# EAGLE design LIC_rack_TS-01 (EAGLE 7.2.0)
AUTHOR: M. Petrilak; VERSION: 00

## Sheet 1 of 3
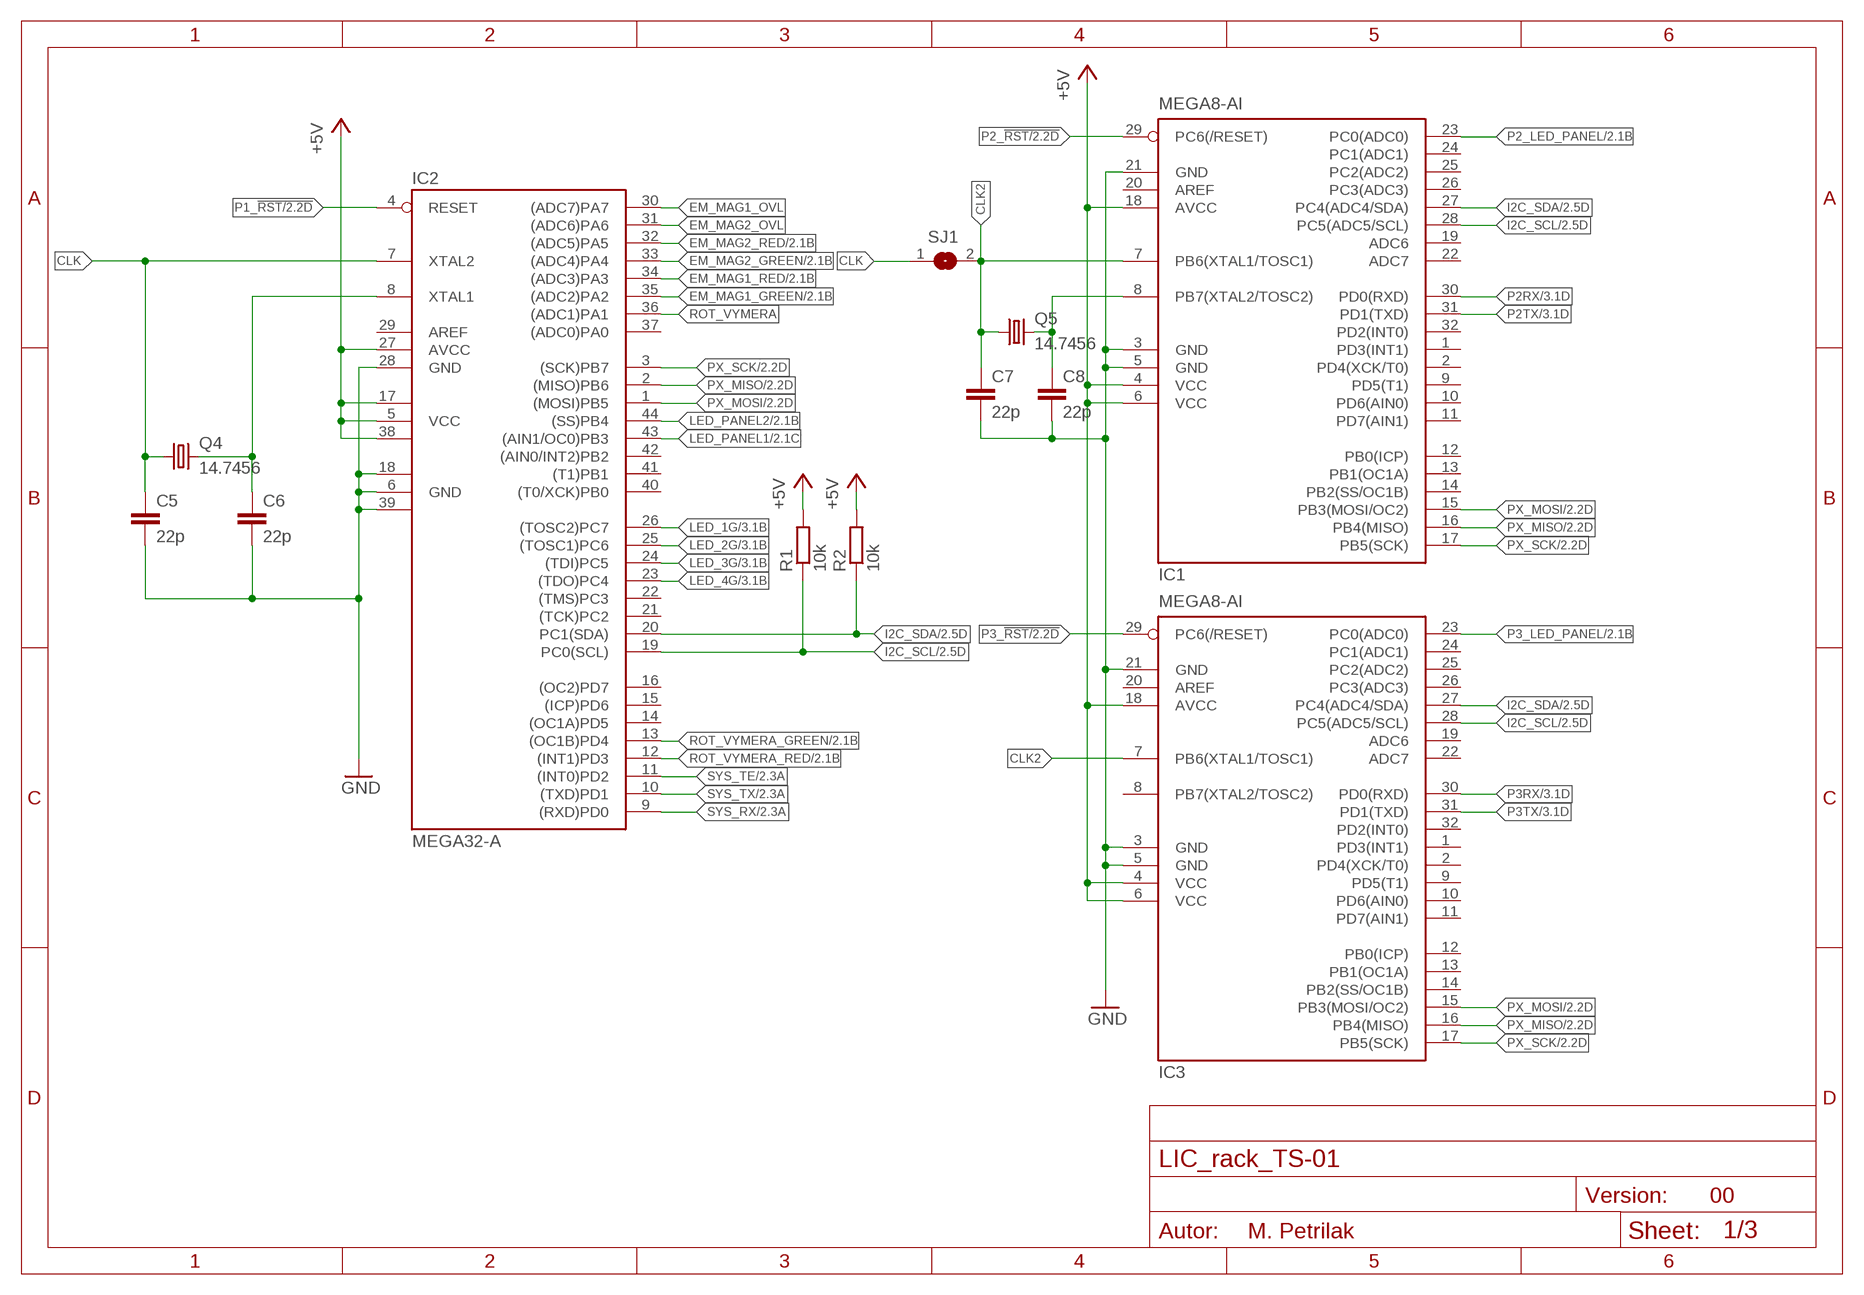
[diagram p0: schematic, sheet 1]

### Parts
C5  22p  C-EUC0805  [C0805]
C6  22p  C-EUC0805  [C0805]
C7  22p  C-EUC0805  [C0805]
C8  22p  C-EUC0805  [C0805]
IC1  MEGA8-AI  [TQFP32-08]
IC2  MEGA32-A  [TQFP44]
IC3  MEGA8-AI  [TQFP32-08]
Q4  14.7456  XTAL  [HC49U70]
Q5  14.7456  XTAL  [HC49U70]
R1  10k  R-EU_R1206  [R1206]
R2  10k  R-EU_R1206  [R1206]
SJ1  SJ-DEFAULT  [SJ-D]

### Nets
+5V: IC1.4(VCC) IC1.6(VCC) IC1.18(AVCC) IC2.5(VCC) IC2.17(VCC1) IC2.27(AVCC) IC2.38(VCC2) IC3.4(VCC) IC3.6(VCC) IC3.18(AVCC) R1.2 R2.2 ; also sheet 2,3
CLK: C5.1 IC2.7(XTAL2) Q4.1 SJ1.1
CLK2: C7.1 IC1.7(PB6(XTAL1/TOSC1)) IC3.7(PB6(XTAL1/TOSC1)) Q5.1 SJ1.2
EM_MAG1_GREEN: IC2.35((ADC2)PA2) ; also sheet 2
EM_MAG1_OVL: IC2.30((ADC7)PA7) ; also sheet 3
EM_MAG1_RED: IC2.34((ADC3)PA3) ; also sheet 2
EM_MAG2_GREEN: IC2.33((ADC4)PA4) ; also sheet 2
EM_MAG2_OVL: IC2.31((ADC6)PA6) ; also sheet 3
EM_MAG2_RED: IC2.32((ADC5)PA5) ; also sheet 2
GND: C5.2 C6.2 C7.2 C8.2 IC1.3(GND) IC1.5(GND) IC1.21(GND) IC2.6(GND) IC2.18(GND1) IC2.28(GND) IC2.39(GND2) IC3.3(GND) IC3.5(GND) IC3.21(GND) ; also sheet 2,3
I2C_SCL: IC1.28(PC5(ADC5/SCL)) IC2.19(PC0(SCL)) IC3.28(PC5(ADC5/SCL)) R1.1 ; also sheet 2
I2C_SDA: IC1.27(PC4(ADC4/SDA)) IC2.20(PC1(SDA)) IC3.27(PC4(ADC4/SDA)) R2.1 ; also sheet 2
LED_1G: IC2.26((TOSC2)PC7) ; also sheet 3
LED_2G: IC2.25((TOSC1)PC6) ; also sheet 3
LED_3G: IC2.24((TDI)PC5) ; also sheet 3
LED_4G: IC2.23((TDO)PC4) ; also sheet 3
LED_PANEL1: IC2.43((AIN1/OC0)PB3) ; also sheet 2
LED_PANEL2: IC2.44((SS)PB4) ; also sheet 2
N$17: C8.1 IC1.8(PB7(XTAL2/TOSC2)) Q5.2
N$19: C6.1 IC2.8(XTAL1) Q4.2
P1_!RST: IC2.4(RESET) ; also sheet 2
P2_!RST: IC1.29(PC6(/RESET)) ; also sheet 2
P2_LED_PANEL: IC1.23(PC0(ADC0)) ; also sheet 2
P2RX: IC1.30(PD0(RXD)) ; also sheet 3
P2TX: IC1.31(PD1(TXD)) ; also sheet 3
P3_!RST: IC3.29(PC6(/RESET)) ; also sheet 2
P3_LED_PANEL: IC3.23(PC0(ADC0)) ; also sheet 2
P3RX: IC3.30(PD0(RXD)) ; also sheet 3
P3TX: IC3.31(PD1(TXD)) ; also sheet 3
PX_MISO: IC1.16(PB4(MISO)) IC2.2((MISO)PB6) IC3.16(PB4(MISO)) ; also sheet 2
PX_MOSI: IC1.15(PB3(MOSI/OC2)) IC2.1((MOSI)PB5) IC3.15(PB3(MOSI/OC2)) ; also sheet 2
PX_SCK: IC1.17(PB5(SCK)) IC2.3((SCK)PB7) IC3.17(PB5(SCK)) ; also sheet 2
ROT_VYMERA: IC2.36((ADC1)PA1) ; also sheet 3
ROT_VYMERA_GREEN: IC2.13((OC1B)PD4) ; also sheet 2
ROT_VYMERA_RED: IC2.12((INT1)PD3) ; also sheet 2
SYS_RX: IC2.9((RXD)PD0) ; also sheet 2
SYS_TE: IC2.11((INT0)PD2) ; also sheet 2
SYS_TX: IC2.10((TXD)PD1) ; also sheet 2
Unconnected: IC1.1(PD3(INT1)) IC1.2(PD4(XCK/T0)) IC1.9(PD5(T1)) IC1.10(PD6(AIN0)) IC1.11(PD7(AIN1)) IC1.12(PB0(ICP)) IC1.13(PB1(OC1A)) IC1.14(PB2(SS/OC1B)) IC1.19(ADC6) IC1.20(AREF) IC1.22(ADC7) IC1.24(PC1(ADC1)) IC1.25(PC2(ADC2)) IC1.26(PC3(ADC3)) IC1.32(PD2(INT0)) IC2.14((OC1A)PD5) IC2.15((ICP)PD6) IC2.16((OC2)PD7) IC2.21((TCK)PC2) IC2.22((TMS)PC3) IC2.29(AREF) IC2.37((ADC0)PA0) IC2.40((T0/XCK)PB0) IC2.41((T1)PB1) IC2.42((AIN0/INT2)PB2) IC3.1(PD3(INT1)) IC3.2(PD4(XCK/T0)) IC3.8(PB7(XTAL2/TOSC2)) IC3.9(PD5(T1)) IC3.10(PD6(AIN0)) IC3.11(PD7(AIN1)) IC3.12(PB0(ICP)) IC3.13(PB1(OC1A)) IC3.14(PB2(SS/OC1B)) IC3.19(ADC6) IC3.20(AREF) IC3.22(ADC7) IC3.24(PC1(ADC1)) IC3.25(PC2(ADC2)) IC3.26(PC3(ADC3)) IC3.32(PD2(INT0))

## Sheet 2 of 3
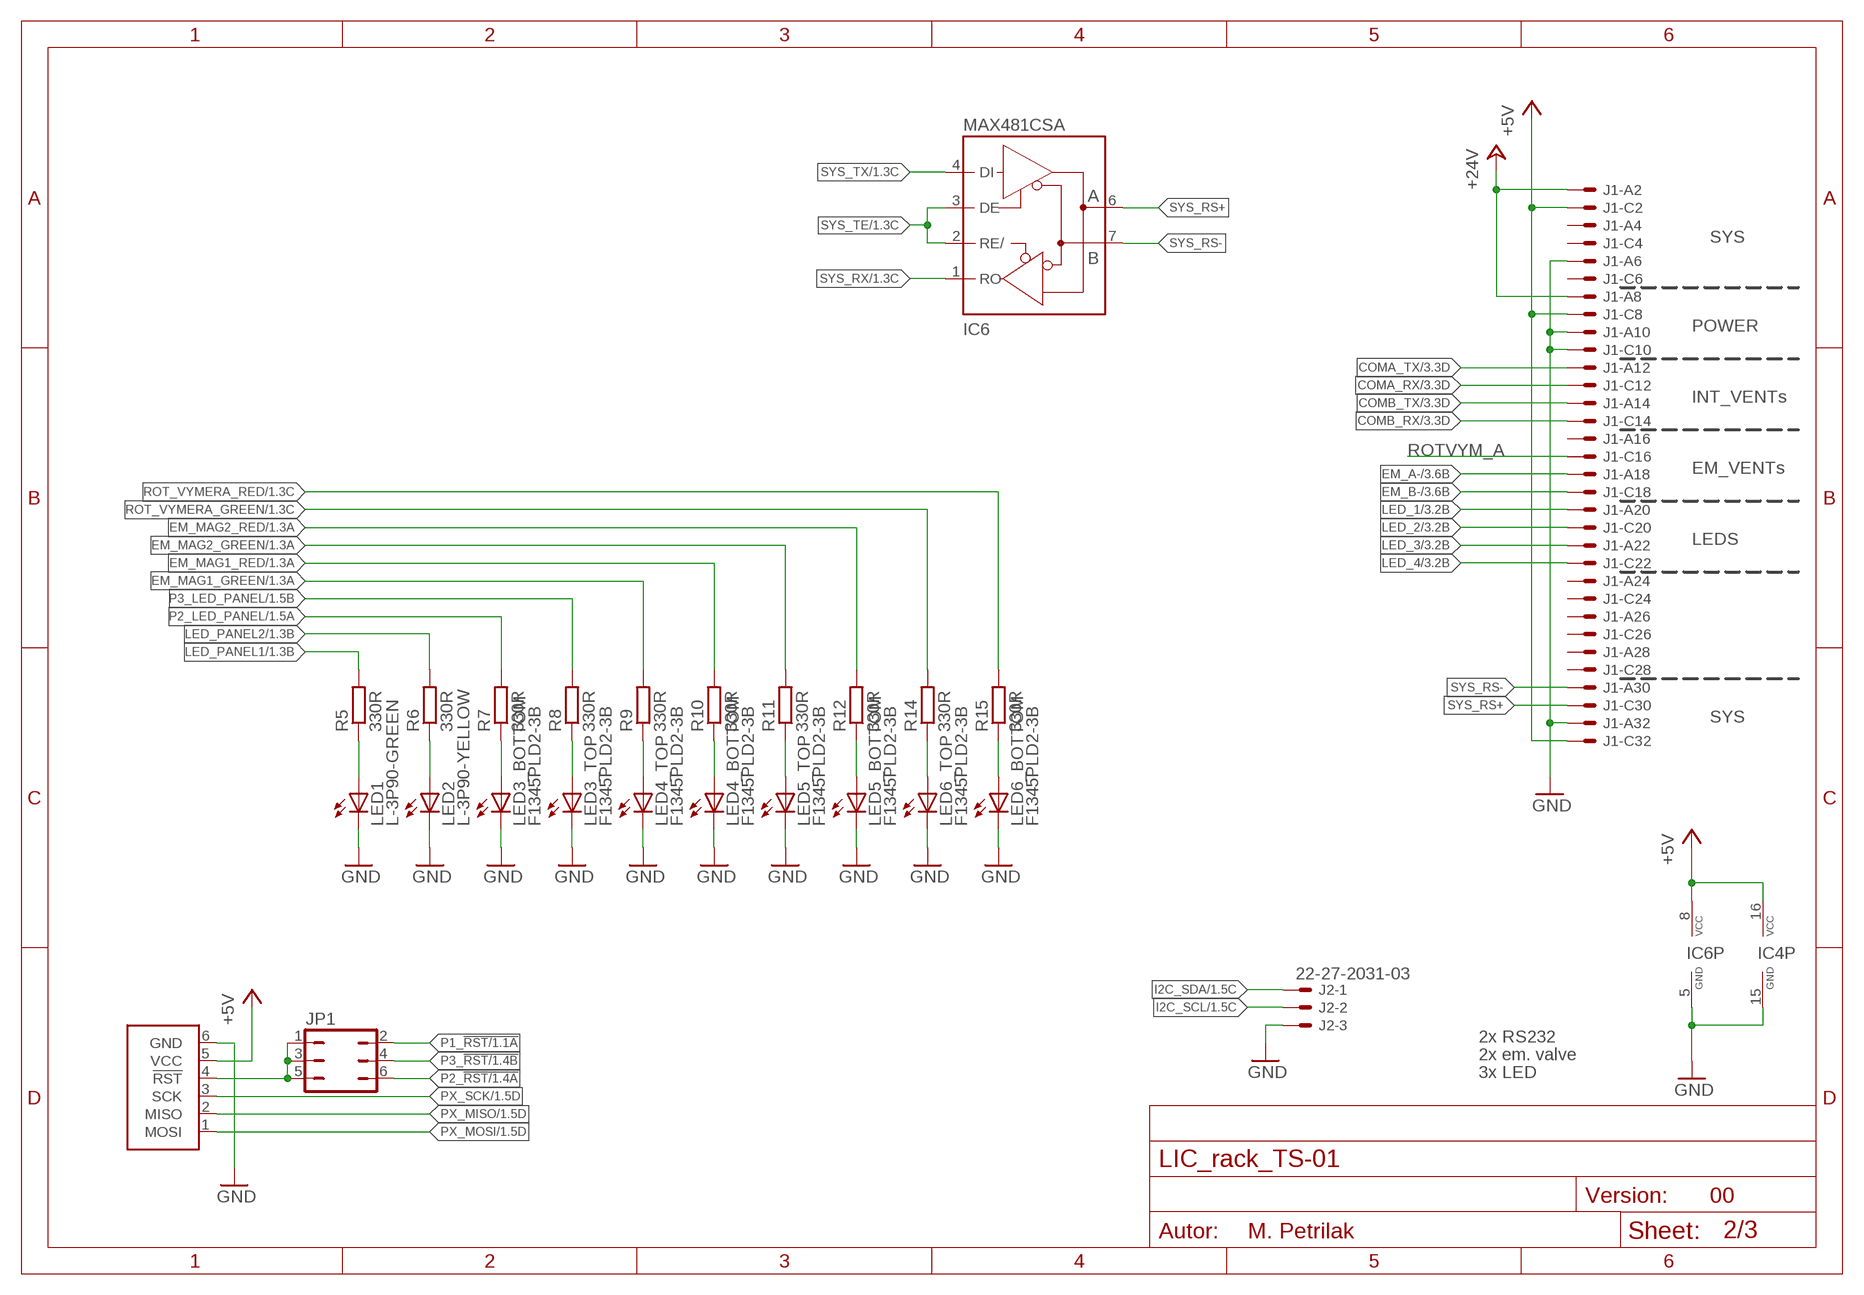
[diagram p1: schematic, sheet 2]

### Parts
IC4  MAX232  [DIL16]
IC6  MAX481CSA  [SO08]
J1  VG32SP  [VG32P]
J2  22-27-2031-03  [6410-03]
JP1  JP3Q  [JP3Q]
LED1  L-3P90-GREEN  [L-3P90]
LED2  L-3P90-YELLOW  [L-3P90]
LED3  F1345PLD2-3B  [F1345PLD2-3B]
LED4  F1345PLD2-3B  [F1345PLD2-3B]
LED5  F1345PLD2-3B  [F1345PLD2-3B]
LED6  F1345PLD2-3B  [F1345PLD2-3B]
R5  330R  R-EU_R1206  [R1206]
R6  330R  R-EU_R1206  [R1206]
R7  330R  R-EU_R1206  [R1206]
R8  330R  R-EU_R1206  [R1206]
R9  330R  R-EU_R1206  [R1206]
R10  330R  R-EU_R1206  [R1206]
R11  330R  R-EU_R1206  [R1206]
R12  330R  R-EU_R1206  [R1206]
R14  330R  R-EU_R1206  [R1206]
R15  330R  R-EU_R1206  [R1206]
U1  ATPROG-V  [6410-06]

### Nets
+5V: IC4.16(VCC) IC6.8(VCC) J1.C2 J1.C8 J1.C32 U1.5(VCC) ; also sheet 1,3
+24V: J1.A2 J1.A8
COMA_RX: J1.C12 ; also sheet 3
COMA_TX: J1.A12 ; also sheet 3
COMB_RX: J1.C14 ; also sheet 3
COMB_TX: J1.A14 ; also sheet 3
EM_A-: J1.A18 ; also sheet 3
EM_B-: J1.C18 ; also sheet 3
EM_MAG1_GREEN: R9.2 ; also sheet 1
EM_MAG1_RED: R10.2 ; also sheet 1
EM_MAG2_GREEN: R11.2 ; also sheet 1
EM_MAG2_RED: R12.2 ; also sheet 1
GND: IC4.15(GND) IC6.5(GND) J1.A6 J1.A10 J1.A32 J1.C10 J2.3 LED1.K(C) LED2.K(C) LED3.1K(C) LED3.2K(C) LED4.1K(C) LED4.2K(C) LED5.1K(C) LED5.2K(C) LED6.1K(C) LED6.2K(C) U1.6(GND) ; also sheet 1,3
I2C_SCL: J2.2 ; also sheet 1
I2C_SDA: J2.1 ; also sheet 1
LED_1: J1.A20 ; also sheet 3
LED_2: J1.C20 ; also sheet 3
LED_3: J1.A22 ; also sheet 3
LED_4: J1.C22 ; also sheet 3
LED_PANEL1: R5.2 ; also sheet 1
LED_PANEL2: R6.2 ; also sheet 1
N$1: LED2.A R6.1
N$2: LED1.A R5.1
N$9: LED4.1A(A) R10.1
N$10: LED4.2A(A) R9.1
N$11: LED3.2A(A) R8.1
N$12: LED3.1A(A) R7.1
N$13: LED5.2A(A) R11.1
N$14: LED5.1A(A) R12.1
N$15: LED6.2A(A) R14.1
N$16: LED6.1A(A) R15.1
P1_!RST: JP1.2 ; also sheet 1
P2_!RST: JP1.6 ; also sheet 1
P2_LED_PANEL: R7.2 ; also sheet 1
P3_!RST: JP1.4 ; also sheet 1
P3_LED_PANEL: R8.2 ; also sheet 1
PROG_!RST: JP1.1 JP1.3 JP1.5 U1.4(!RST)
PX_MISO: U1.2(MISO) ; also sheet 1
PX_MOSI: U1.1(MOSI) ; also sheet 1
PX_SCK: U1.3(SCK) ; also sheet 1
ROT_VYMERA_GREEN: R14.2 ; also sheet 1
ROT_VYMERA_RED: R15.2 ; also sheet 1
ROTVYM_A: J1.C16 ; also sheet 3
SYS_RS+: IC6.6(A) J1.C30
SYS_RS-: IC6.7(B) J1.A30
SYS_RX: IC6.1(RO) ; also sheet 1
SYS_TE: IC6.2(RE/) IC6.3(DE) ; also sheet 1
SYS_TX: IC6.4(DI) ; also sheet 1
Unconnected: J1.A4 J1.A16 J1.A24 J1.A26 J1.A28 J1.C4 J1.C6 J1.C24 J1.C26 J1.C28

### Notes on the sheet
- SYS
- POWER
- INT_VENTs
- EM_VENTs
- LEDS
- SYS
- 2x RS232
- 2x em. valve
- 3x LED

## Sheet 3 of 3
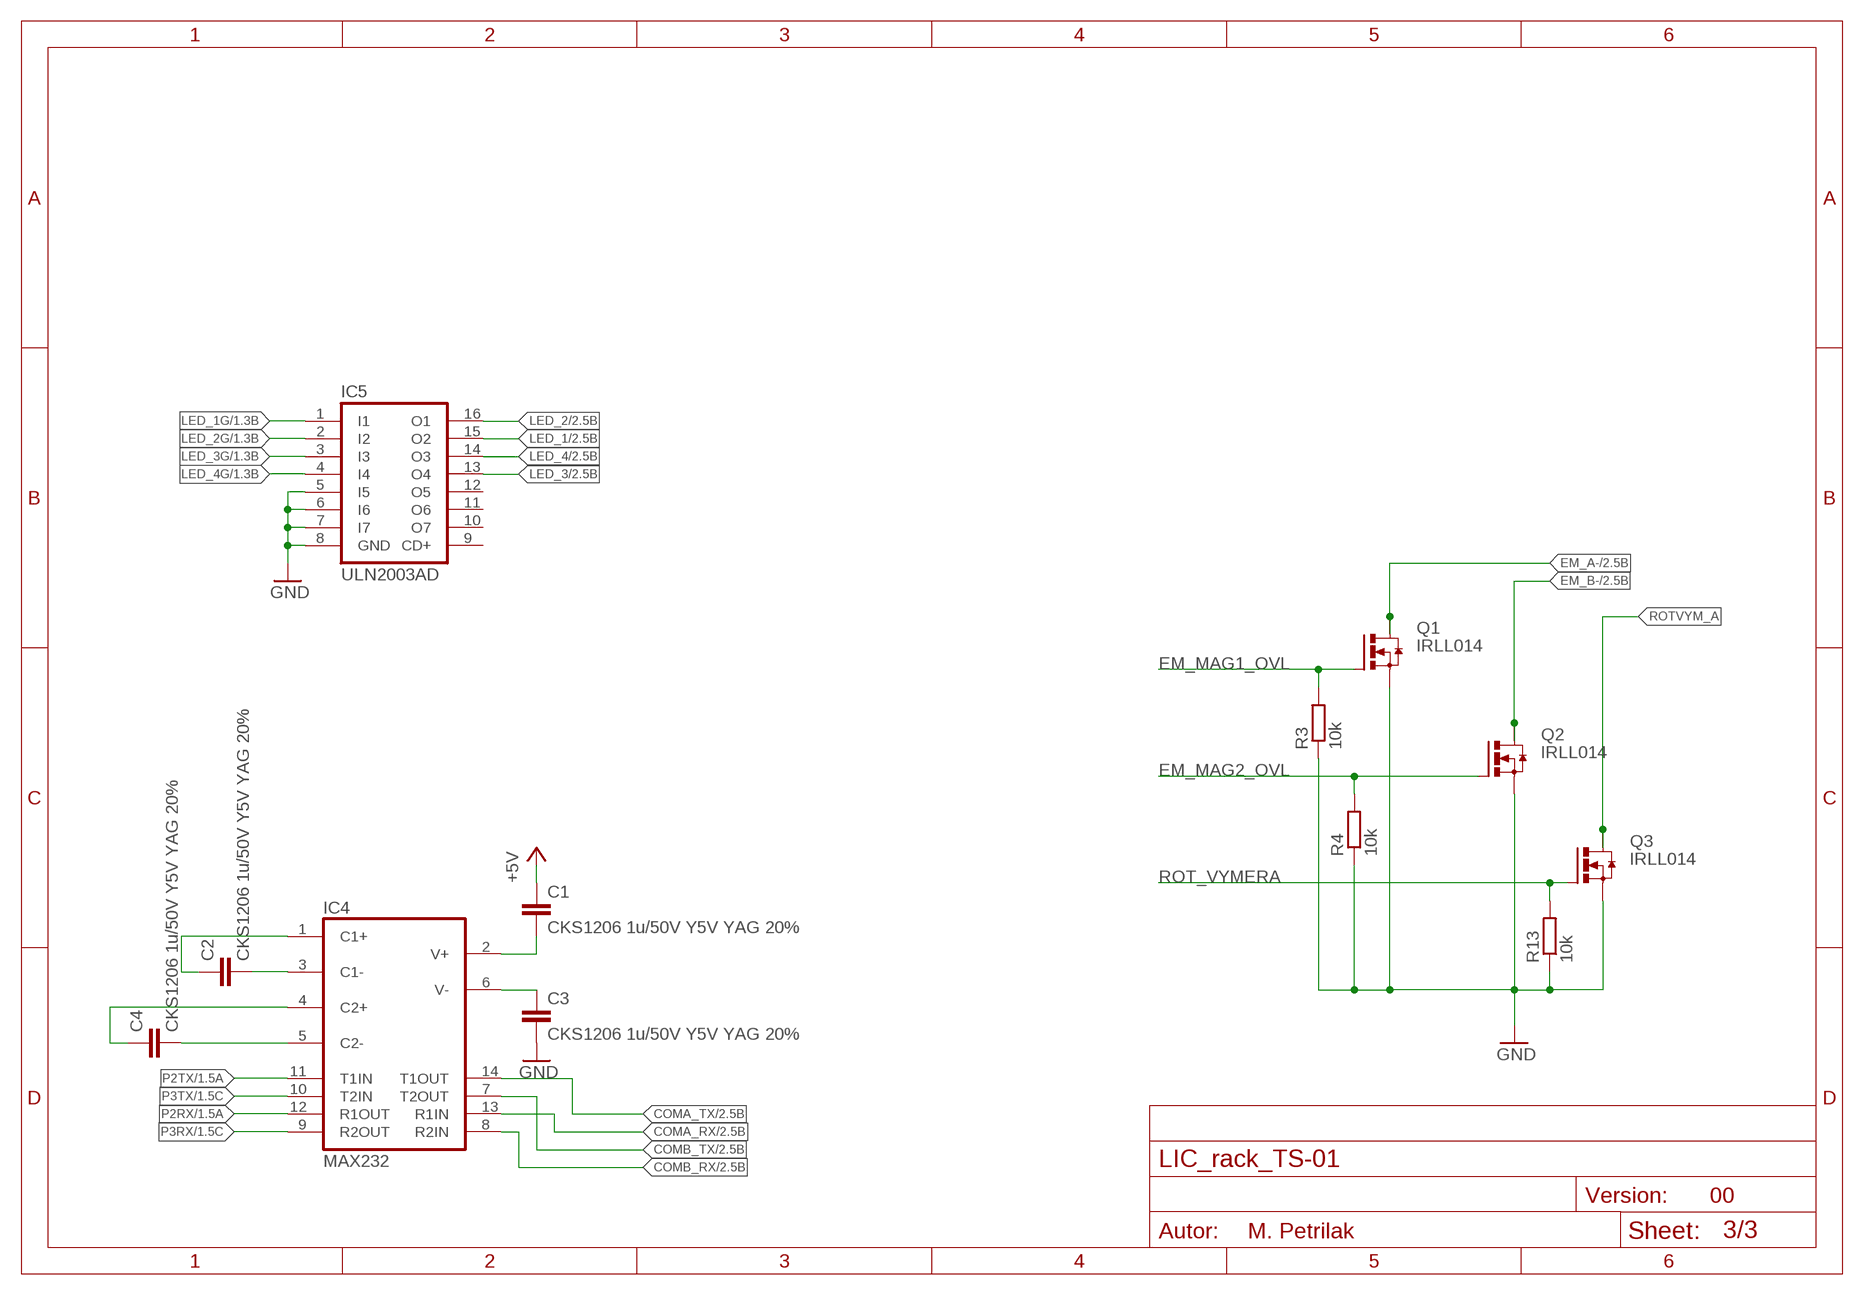
[diagram p2: schematic, sheet 3]

### Parts
C1  CKS1206 1u/50V Y5V YAG 20%  C-EUC1206  [C1206]
C2  CKS1206 1u/50V Y5V YAG 20%  C-EUC1206  [C1206]
C3  CKS1206 1u/50V Y5V YAG 20%  C-EUC1206  [C1206]
C4  CKS1206 1u/50V Y5V YAG 20%  C-EUC1206  [C1206]
IC5  ULN2003AD  [SO16]
Q1  IRLL014  [SOT223]
Q2  IRLL014  [SOT223]
Q3  IRLL014  [SOT223]
R3  10k  R-EU_R1206  [R1206]
R4  10k  R-EU_R1206  [R1206]
R13  10k  R-EU_R1206  [R1206]

### Nets
+5V: C1.1 ; also sheet 1,2
COMA_RX: IC4.13(R1IN) ; also sheet 2
COMA_TX: IC4.14(T1OUT) ; also sheet 2
COMB_RX: IC4.8(R2IN) ; also sheet 2
COMB_TX: IC4.7(T2OUT) ; also sheet 2
EM_A-: Q1.2(D) Q1.4(D) ; also sheet 2
EM_B-: Q2.2(D) Q2.4(D) ; also sheet 2
EM_MAG1_OVL: Q1.1(G) R3.2 ; also sheet 1
EM_MAG2_OVL: Q2.1(G) R4.2 ; also sheet 1
GND: C3.2 IC5.5(I5) IC5.6(I6) IC5.7(I7) IC5.8(GND) Q1.3(S) Q2.3(S) Q3.3(S) R3.1 R4.1 R13.1 ; also sheet 1,2
LED_1: IC5.15(O2) ; also sheet 2
LED_1G: IC5.1(I1) ; also sheet 1
LED_2: IC5.16(O1) ; also sheet 2
LED_2G: IC5.2(I2) ; also sheet 1
LED_3: IC5.13(O4) ; also sheet 2
LED_3G: IC5.3(I3) ; also sheet 1
LED_4: IC5.14(O3) ; also sheet 2
LED_4G: IC5.4(I4) ; also sheet 1
N$3: C4.2 IC4.5(C2-)
N$4: C4.1 IC4.4(C2+)
N$5: C2.2 IC4.3(C1-)
N$6: C2.1 IC4.1(C1+)
N$7: C1.2 IC4.2(V+)
N$8: C3.1 IC4.6(V-)
P2RX: IC4.12(R1OUT) ; also sheet 1
P2TX: IC4.11(T1IN) ; also sheet 1
P3RX: IC4.9(R2OUT) ; also sheet 1
P3TX: IC4.10(T2IN) ; also sheet 1
ROT_VYMERA: Q3.1(G) R13.2 ; also sheet 1
ROTVYM_A: Q3.2(D) Q3.4(D) ; also sheet 2
Unconnected: IC5.9(CD+) IC5.10(O7) IC5.11(O6) IC5.12(O5)

## Library data of the parts
C1-C8 = rcl:C-EU: CAPACITOR, European symbol
IC1 IC3 = atmel:MEGA8: MICROCONTROLLER 8 Kbytes FLASH, 1 kbytes SRAM, 512 bytes EEPROM, USART, 6-channel 10 bit ADC, 2-channel 8 bit ADC Pin compatible with Atmega48, ATMega88, ATMega168 Source: avr.lbr
IC2 = atmel:MEGA32: MICROCONTROLLER 32 Kbytes FLASH 2 Kbytes SRAM 1 Kbytes EEPROM USART 8-channel 10 bit ADC Source: www.atmel.com .. doc2503.pdf
IC4 = maxim:MAX232: RS232 TRANSEIVER
IC5 = uln-udn:ULN2003A: DRIVER ARRAY
IC6 = maxim:MAX481CSA: RS485 TRANSEIVER
J1 = 19inch:VG32S: PCB EUROCARD, 32-pin type C/AC, 5.08 mm
J2 = con-molex:22-?-03: CONNECTOR wire to board 2.54 mm (.1 inch) pitch header
JP1 = jumper:JP3Q: JUMPER
LED1 LED2 = led:L-3P90
LED3-LED6 = led:F1345PLD2-3B
Q1-Q3 = transistor-power:IRLL014: HEXFET® Power MOSFET 2 Drain connects http://www.irf.com/product-info/datasheets/data/irll014n.pdf
Q4 Q5 = crystal:XTAL
R1-R15 = rcl:R-EU_: RESISTOR, European symbol
SJ1 = jumper:SJ: SMD solder JUMPER
U1 = con-molex:ATPROG

## Board
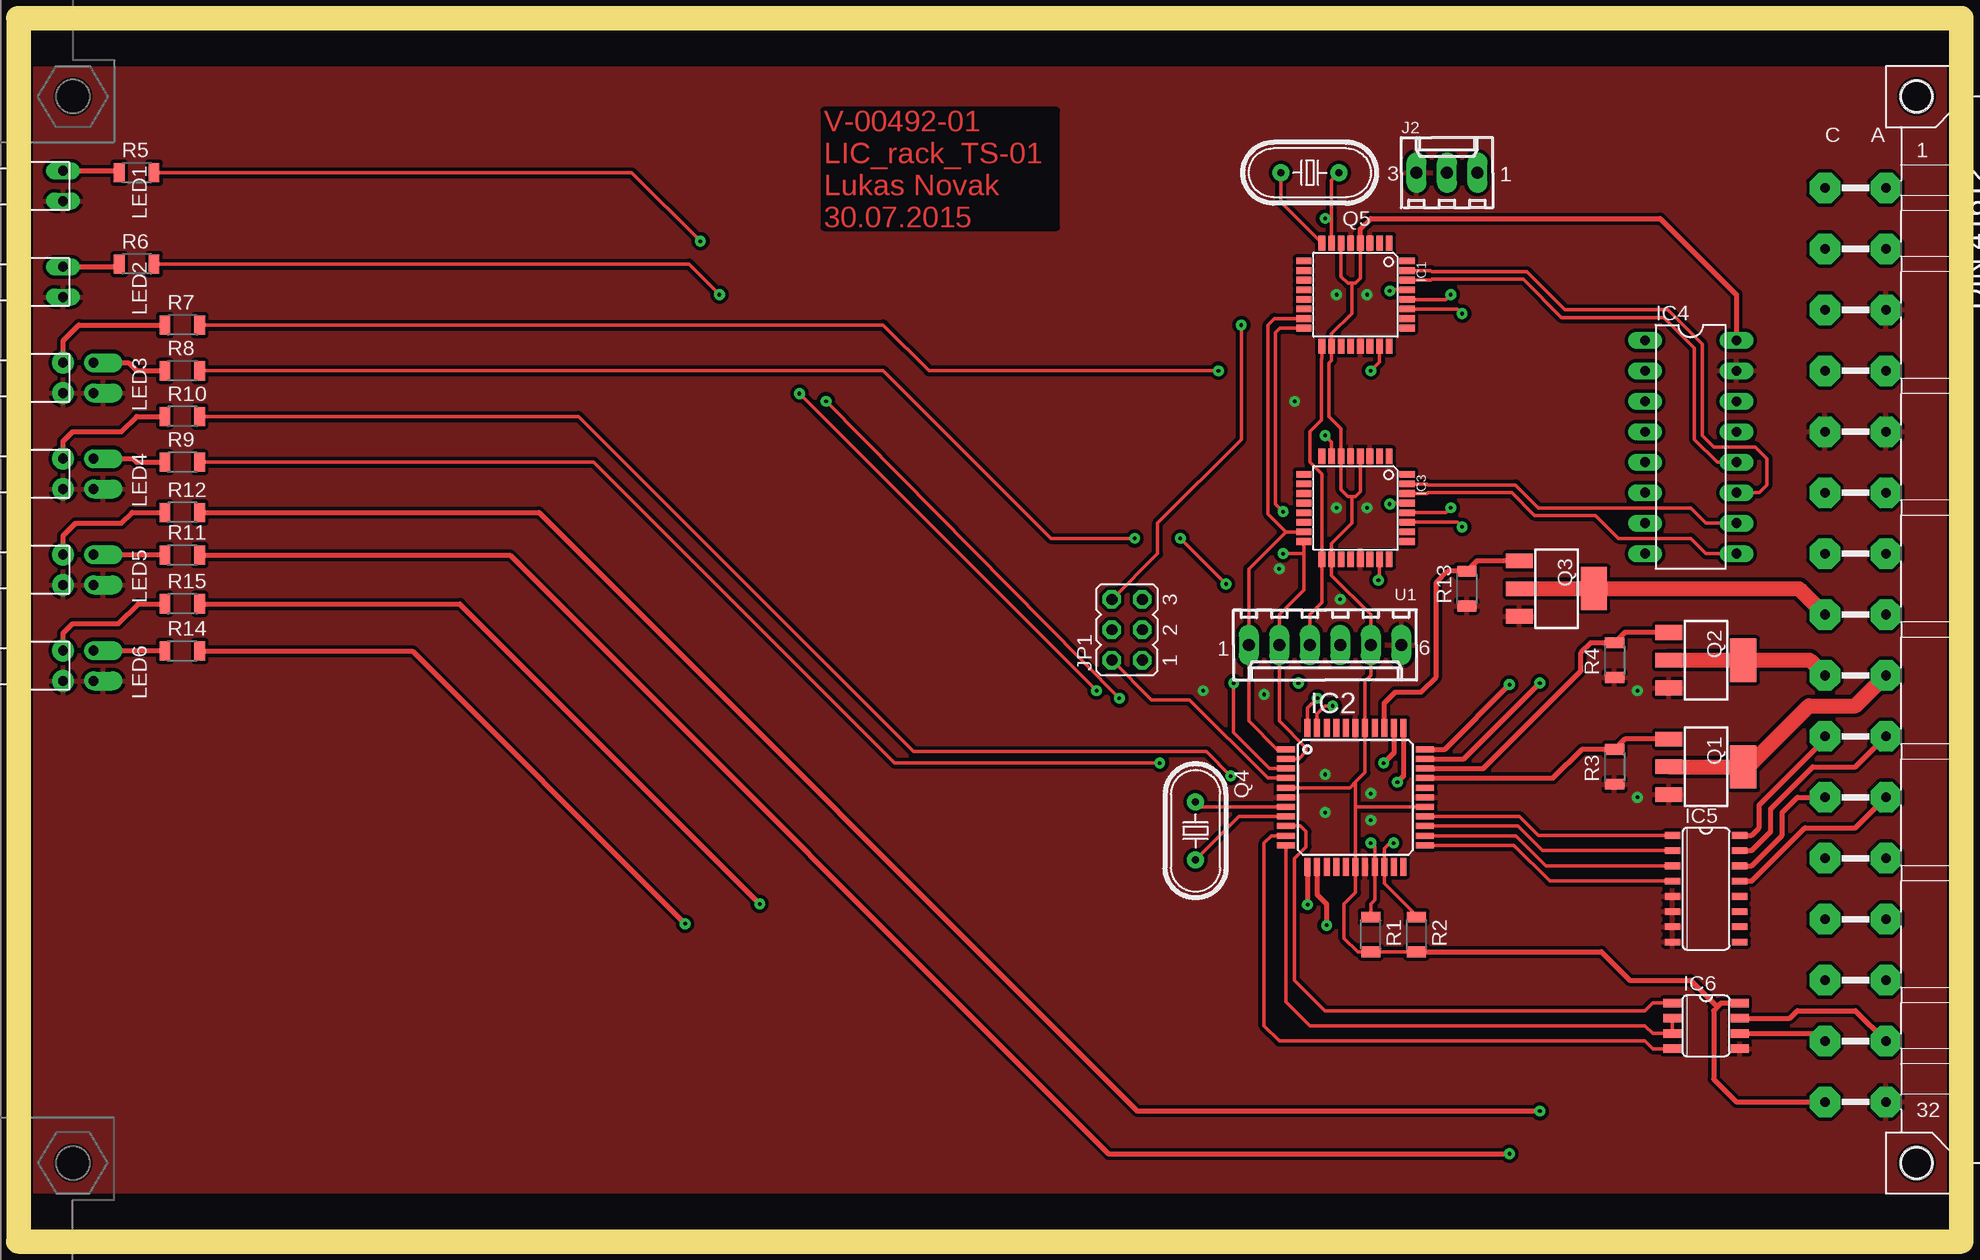
[diagram p3: board, top side]
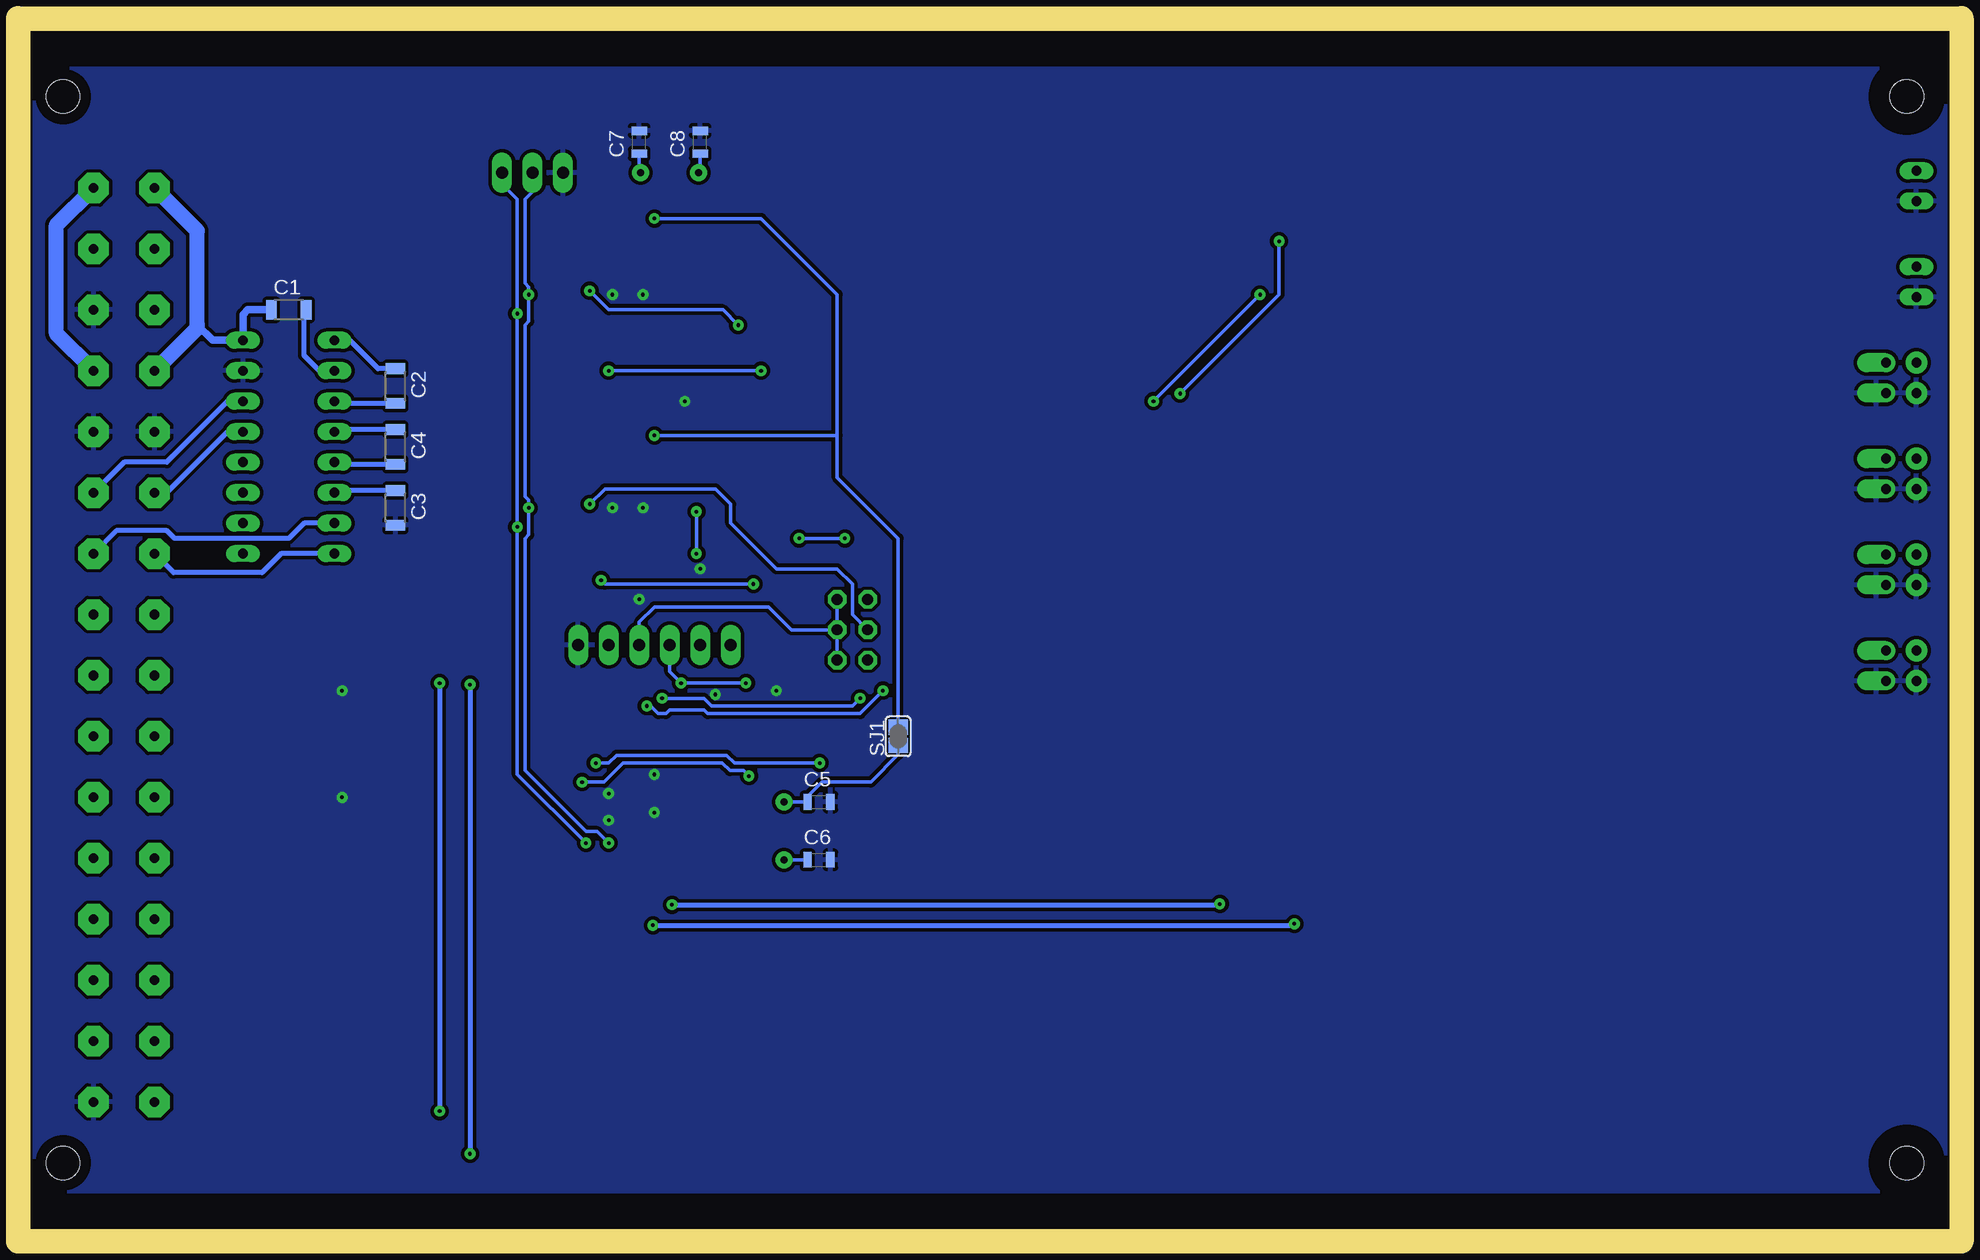
[diagram p4: board, bottom side, seen from below]

Size 160 x 100 mm. Coordinates in mm from the lower left corner, seen from the top.
Copper layers (1*16): Top 0.04mm / dielectric 1.5mm / Bottom 0.04mm
Design rules "mucha_navrh_my_fine": minimum track width 0.2mm, minimum drill 0.6mm, track to track 0.3mm, track to pad 0.3mm, pad to pad 0.3mm, via to via 0.3mm, smd to smd 0mil, copper to edge 0.2mm, drill to drill 0.2mm, minimum pad ring 0.3mm, minimum via ring 0.3mm, stop-mask expansion 0.1mm, vias tented up to drill 0.5mm, thermal gap 0.3mm

### Footprints (pad centres in the part's own frame; a part is rotated, then mirrored left to right if it is on the bottom)
C1206 = smd 0.9 x 1.6: 1 -1.45,0; 2 1.45,0
C0805 = smd 0.7 x 1.3: 1 -0.95,0; 2 0.95,0
TQFP32-08 = smd 1.27 x 0.559: 1 -4.293,2.8; 2 -4.293,2; 3 -4.293,1.2; 4 -4.293,0.4; 5 -4.293,-0.4; 6 -4.293,-1.2; 7 -4.293,-2; 8 -4.293,-2.8; 17 4.293,-2.8; 18 4.293,-2; 19 4.293,-1.2; 20 4.293,-0.4; 21 4.293,0.4; 22 4.293,1.2; 23 4.293,2; 24 4.293,2.8 | smd 0.559 x 1.27: 9 -2.8,-4.293; 10 -2,-4.293; 11 -1.2,-4.293; 12 -0.4,-4.293; 13 0.4,-4.293; 14 1.2,-4.293; 15 2,-4.293; 16 2.8,-4.293; 25 2.8,4.293; 26 2,4.293; 27 1.2,4.293; 28 0.4,4.293; 29 -0.4,4.293; 30 -1.2,4.293; 31 -2,4.293; 32 -2.8,4.293
TQFP44 = smd 1.5 x 0.5: 1 -5.8,4; 2 -5.8,3.2; 3 -5.8,2.4; 4 -5.8,1.6; 5 -5.8,0.8; 6 -5.8,0; 7 -5.8,-0.8; 8 -5.8,-1.6; 9 -5.8,-2.4; 10 -5.8,-3.2; 11 -5.8,-4; 23 5.8,-4; 24 5.8,-3.2; 25 5.8,-2.4; 26 5.8,-1.6; 27 5.8,-0.8; 28 5.8,0; 29 5.8,0.8; 30 5.8,1.6; 31 5.8,2.4; 32 5.8,3.2; 33 5.8,4 | smd 0.5 x 1.5: 12 -4,-5.8; 13 -3.2,-5.8; 14 -2.4,-5.8; 15 -1.6,-5.8; 16 -0.8,-5.8; 17 0,-5.8; 18 0.8,-5.8; 19 1.6,-5.8; 20 2.4,-5.8; 21 3.2,-5.8; 22 4,-5.8; 34 4,5.8; 35 3.2,5.8; 36 2.4,5.8; 37 1.6,5.8; 38 0.8,5.8; 39 0,5.8; 40 -0.8,5.8; 41 -1.6,5.8; 42 -2.4,5.8; 43 -3.2,5.8; 44 -4,5.8
DIL16 = drill 0.813 long: 1 -8.89,-3.81; 2 -6.35,-3.81; 3 -3.81,-3.81; 4 -1.27,-3.81; 5 1.27,-3.81; 6 3.81,-3.81; 7 6.35,-3.81; 8 8.89,-3.81; 9 8.89,3.81; 10 6.35,3.81; 11 3.81,3.81; 12 1.27,3.81; 13 -1.27,3.81; 14 -3.81,3.81; 15 -6.35,3.81; 16 -8.89,3.81
SO16 = smd 0.553 x 1.3: 1 -4.445,-2.8; 2 -3.175,-2.8; 3 -1.905,-2.8; 4 -0.635,-2.8; 5 0.635,-2.8; 6 1.905,-2.8; 7 3.175,-2.8; 8 4.445,-2.8; 9 4.445,2.8; 10 3.175,2.8; 11 1.905,2.8; 12 0.635,2.8; 13 -0.635,2.8; 14 -1.905,2.8; 15 -3.175,2.8; 16 -4.445,2.8
SO08 = smd 0.72 x 1.5: 1 -1.905,-2.8; 2 -0.635,-2.8; 3 0.635,-2.8; 4 1.905,-2.8; 5 1.905,2.8; 6 0.635,2.8; 7 -0.635,2.8; 8 -1.905,2.8
VG32P = drill 0.8 pad 2.54 octagon: A2 154.7,36.83; A4 154.7,31.75; A6 154.7,26.67; A8 154.7,21.59; A10 154.7,16.51; A12 154.7,11.43; A14 154.7,6.35; A16 154.7,1.27; A18 154.7,-3.81; A20 154.7,-8.89; A22 154.7,-13.97; A24 154.7,-19.05; A26 154.7,-24.13; A28 154.7,-29.21; A30 154.7,-34.29; A32 154.7,-39.37; C2 149.62,36.83; C4 149.62,31.75; C6 149.62,26.67; C8 149.62,21.59; C10 149.62,16.51; C12 149.62,11.43; C14 149.62,6.35; C16 149.62,1.27; C18 149.62,-3.81; C20 149.62,-8.89; C22 149.62,-13.97; C24 149.62,-19.05; C26 149.62,-24.13; C28 149.62,-29.21; C30 149.62,-34.29; C32 149.62,-39.37 | hole 2.794: 3.57,44.45; 3.57,-44.45; 157.24,44.45; 157.24,-44.45; 3.57,44.45; 3.57,-44.45; 157.24,44.45; 157.24,-44.45
6410-03 = drill 1.016 long: 1 2.54,0; 2 0,0; 3 -2.54,0
JP3Q = drill 0.914 octagon: 1 -2.54,-1.27; 2 -2.54,1.27; 3 0,-1.27; 4 0,1.27; 5 2.54,-1.27; 6 2.54,1.27
L-3P90 = drill 0.813 long: A 4.7,1.27; K 4.7,-1.27
F1345PLD2-3B = drill 0.8 pad 1.8: 1A 4.7,1.27; 1K 4.7,-1.27 | drill 0.8 pad 1.6 offset: 2A 7.24,1.27; 2K 7.24,-1.27
SOT223 = smd 1.219 x 2.235: 1 -2.311,-3.099; 2 0,-3.099; 3 2.311,-3.099 | smd 3.6 x 2.2: 4 0,3.099
HC49U70 = drill 0.6 pad 1.4: 1 -2.413,0; 2 2.413,0
R1206 = smd 0.9 x 1.6: 1 -1.45,0; 2 1.45,0
SJ-D = smd 1.27 x 1.6: 1 -0.762,0; 2 0.762,0
6410-06 = drill 1.016 long: 1 6.35,0; 2 3.81,0; 3 1.27,0; 4 -1.27,0; 5 -3.81,0; 6 -6.35,0

### Placement (x,y rotation side)
C1  138.43,76.67 0 bottom
C2  129.54,70.32 270 bottom
C3  129.54,60.16 270 bottom
C4  129.54,65.24 270 bottom
C5  94.23,35.65 0 bottom
C6  94.23,30.82 0 bottom
C7  109.22,90.64 90 bottom
C8  104.14,90.64 90 bottom
IC1  110.49,77.94 270 top
IC2  110.49,36.03 0 top
IC3  110.49,60.16 270 top
IC4  138.43,65.24 270 top
IC5  139.7,28.41 270 top
IC6  139.7,16.98 270 top
J1  0,50 0 top
J2  118.11,88.1 0 top
JP1  91.44,50 90 top
LED1  -1.94,87 0 top
LED2  -1.94,79 0 top
LED3  -1.94,71 0 top
LED4  -1.94,63 0 top
LED5  -1.94,55 0 top
LED6  -1.94,47 0 top
Q1  139.7,38.57 270 top
Q2  139.7,47.46 270 top
Q3  127.25,53.43 270 top
Q4  97.16,33.24 270 top
Q5  106.68,88.1 180 top
R1  111.76,24.6 270 top
R2  115.57,24.6 270 top
R3  132.08,38.57 90 top
R4  132.08,47.46 90 top
R5  8.89,88.1 0 top
R6  8.89,80.48 0 top
R7  12.7,75.4 0 top
R8  12.7,71.59 0 top
R9  12.7,63.97 0 top
R10  12.7,67.78 0 top
R11  12.7,56.22 0 top
R12  12.7,59.78 0 top
R13  119.76,53.43 90 top
R14  12.7,48.22 0 top
R15  12.7,52.16 0 top
SJ1  87.63,41.11 90 bottom
U1  107.95,48.73 180 top

### Tracks (layer width: path | path; a pad name or v marks a point on that pad's centre or on a via)
+5V
  Top 0.305: IC2.5 110.02,36.83 110.49,37.3 | 110.49,37.3 111.29,38.1 IC2.38 111.29,45.72 111.76,46.19 U1.5 111.76,51.27 108.49,54.54 IC3.18 108.49,57.21 110.17,58.89 110.17,61.11 | IC2.27 110.66,35.23 110.49,35.39 | 110.49,35.39 110.49,37.3 | 110.49,35.39 IC2.17 110.49,28.09 109.54,27.14 109.54,24.28 110.67,23.15 R1.2 R2.2 | IC3.4 110.89,61.51 110.49,61.11 110.17,61.11 | 110.17,61.11 109.86,61.11 109.29,61.68 IC3.6 109.29,66.76 108.27,67.78 108.27,72.22 108.49,72.45 IC1.18 108.49,74.67 110.17,76.35 110.17,78.89 | IC1.6 109.29,79.46 109.86,78.89 110.17,78.89 | 110.17,78.89 110.49,78.89 110.89,79.29 IC1.4
  Top 0.406: J1.C32 142.24,10.63 140.34,12.53 140.34,18.25 140.65,18.57 | 140.65,18.57 140.97,18.89 IC6.8 | IC1.4 110.89,83.42 111.76,84.29 135.89,84.29 142.24,77.94 IC4.16 | R2.2 130.99,23.15 133.35,20.79 138.43,20.79 140.65,18.57
  Bottom 0.61: 146.05,75.4 144.78,74.13 IC4.16 142.24,76.29 141.86,76.67 C1.1
  Bottom 1.27: J1.C8 146.05,75.16 146.05,75.4 146.05,83.26 J1.C2
+24V
  Bottom 1.27: J1.A2 157.8,83.73 157.8,74.69 J1.A8
CLK
  Top 0.305: IC2.7 97.57,35.23 Q4.1
  Bottom 0.305: 97.16,35.78 Q4.1 C5.1 95.18,36.1 93.98,37.3 89.92,37.3 87.63,39.59 SJ1.1
CLK2  (via drill 0.3)
  Top 0.305: IC1.7 108.49,84.29 | 108.49,84.29 108.49,87.5 Q5.1 | v107.95,84.29 108.49,84.29 | IC3.7 108.49,65.65 v107.95,66.19
  Bottom 0.305: C7.1 109.22,88.23 Q5.1 | SJ1.2 87.63,57.62 92.71,62.7 92.71,66.19 | 92.71,66.19 92.71,77.94 99.06,84.29 v107.95,84.29 | v107.95,66.19 92.71,66.19
COMA_RX
  Bottom 0.406: J1.C12 148.59,61.43 143.51,66.51 IC4.13
COMA_TX
  Bottom 0.406: J1.A12 152.16,63.97 148.59,63.97 143.51,69.05 IC4.14
COMB_RX
  Bottom 0.406: IC4.8 139.06,56.35 140.65,54.76 148.03,54.76 J1.C14
COMB_TX
  Bottom 0.406: IC4.7 137.16,58.89 138.43,57.62 147.96,57.62 148.59,58.26 152.79,58.26 J1.A14
EM_A-
  Top 1.27: Q1.2 Q1.4 143.19,38.57 148.27,43.65 152.16,43.65 J1.A18
EM_B-
  Top 1.27: Q2.2 Q2.4 148.35,47.46 J1.C18
EM_MAG1_GREEN  (via drill 0.3)
  Top 0.305: R9.2 46.99,63.97 72.07,38.89 v94.17,38.89
  Top 0.406: IC2.35 113.69,39.74 v112.84,38.89
  Bottom 0.305: v94.17,38.89 101.28,38.89 101.92,39.52 111.12,39.52 111.76,38.89 v112.84,38.89
EM_MAG1_OVL
  Top 0.406: Q1.1 132.94,40.88 R3.2 129.34,40.02 126.95,37.63 IC2.30
EM_MAG1_RED  (via drill 0.3)
  Top 0.305: R10.2 45.72,67.78 73.66,39.84 98.04,39.84 v100.08,37.81
  Top 0.406: IC2.34 114.49,37.81 v113.98,37.3
  Bottom 0.305: v113.98,37.3 112.14,37.3 110.55,38.89 102.3,38.89 101.66,38.25 100.52,38.25 v100.08,37.81
EM_MAG2_GREEN  (via drill 0.3)
  Top 0.406: R11.2 40.01,56.22 89.92,6.31 v123.32,6.31 | IC2.33 117.92,40.03 v123.32,45.43
  Bottom 0.406: v123.32,45.43 v123.32,6.31
EM_MAG2_OVL
  Top 0.406: IC2.31 121.14,38.43 129.29,46.57 129.29,48.09 130.1,48.91 R4.2 132.94,49.77 Q2.1
EM_MAG2_RED  (via drill 0.3)
  Top 0.406: R12.2 42.42,59.78 92.33,9.87 v125.86,9.87 | IC2.32 119.53,39.23 v125.86,45.55
  Bottom 0.406: v125.86,45.55 v125.86,9.87
GND  (via drill 0.3)
  other vias: 107.95,34.76 111.76,36.35 107.95,37.94 108.9,60.16 111.44,60.16 108.9,77.94 111.44,77.94 105.41,69.05 133.99,44.92 133.99,36.03 111.76,34.12 104.14,55.08 102.87,44.6 97.79,44.92 109.22,52.54
  pour Bottom: 0,-0.8 160.02,-0.8 160.02,99.53 0,99.53
  pour Top: 0,0.47 160.02,0.47 160.02,99.53 0,99.53
I2C_SCL  (via drill 0.3)
  Top 0.305: R1.1 111.76,27.14 112.09,27.47 IC2.19 112.09,31.89 v111.76,32.22 | IC3.28 118.03,59.76 v118.43,60.16 | IC1.28 118.03,77.54 v118.43,77.94
  Bottom 0.305: v111.76,32.22 112.71,33.17 113.67,33.17 118.75,38.25 118.75,57.62 118.43,57.94 v118.43,60.16 118.43,60.8 118.75,61.11 118.75,75.4 118.43,75.72 v118.43,77.94 118.43,78.58 118.75,78.89 118.75,85.88 118.11,86.51 J2.2
I2C_SDA  (via drill 0.3)
  Top 0.305: R2.1 115.57,26.19 112.89,28.87 IC2.20 112.89,31.76 113.35,32.22 v113.67,32.22 | IC1.27 118.99,76.74 v119.38,76.35 | IC3.27 118.99,58.96 v119.38,58.57
  Bottom 0.305: v113.67,32.22 119.38,37.94 v119.38,58.57 v119.38,76.35 119.38,85.88 120.65,87.15 J2.1
LED_1
  Top 0.406: J1.A20 152.16,38.57 148.59,38.57 145.1,35.08 145.1,33.17 143.51,31.59 IC5.15
LED_1G
  Top 0.305: IC2.26 124.16,34.43 125.73,32.86 IC5.1
LED_2
  Top 0.406: J1.C20 149.62,40.87 144.15,35.39 144.15,33.49 143.51,32.86 IC5.16
LED_2G
  Top 0.305: IC2.25 124,33.63 126.05,31.59 IC5.2
LED_3
  Top 0.406: J1.A22 152.16,33.49 147.96,33.49 143.51,29.05 IC5.13
LED_3G
  Top 0.305: IC2.24 123.85,32.83 126.36,30.32 IC5.3
LED_4
  Top 0.406: J1.C22 147.32,36.03 146.05,34.76 146.05,32.86 143.51,30.32 IC5.14
LED_4G
  Top 0.305: IC2.23 123.7,32.03 126.68,29.05 IC5.4
LED_PANEL1  (via drill 0.3)
  Top 0.305: IC2.43 107.29,42.99 107.95,43.65 v108.58,43.65 | v64.14,69.69 v88.9,44.92 | v55.88,82.38 50.16,88.1 R5.2
  Bottom 0.305: v108.58,43.65 108.27,43.65 107.63,43.02 107,43.02 106.68,43.33 103.82,43.33 103.5,43.02 90.81,43.02 v88.9,44.92 | v64.14,69.69 55.88,77.94 v55.88,82.38
LED_PANEL2  (via drill 0.3)
  Top 0.305: IC2.44 106.49,43.46 v107.31,44.28 | v66.36,69.05 v90.81,44.28 | R6.2 54.93,80.48 v57.47,77.94
  Bottom 0.305: v107.31,44.28 103.82,44.28 103.19,43.65 91.44,43.65 v90.81,44.28 | v57.47,77.94 v66.36,69.05
N$1
  Top 0.406: LED2.A 7.23,80.27 R6.1
N$2
  Top 0.406: LED1.A 7.27,88.27 R5.1
N$3
  Bottom 0.406: C4.2 134.44,63.79 IC4.5
N$4
  Bottom 0.406: C4.1 134.44,66.69 IC4.4
N$5
  Bottom 0.406: C2.2 134.44,68.87 IC4.3
N$6
  Bottom 0.406: C2.1 130.99,71.77 133.35,74.13 IC4.1
N$7
  Bottom 0.406: IC4.2 135.89,71.59 137.16,72.86 137.16,76.49 C1.2
N$8
  Bottom 0.406: C3.1 134.44,61.61 IC4.6
N$9
  Top 0.406: R10.1 8.89,67.78 7.62,66.51 3.56,66.51 2.76,65.71 LED4.1A
N$10
  Top 0.406: LED4.2A 8.59,64.27 8.89,63.97 R9.1
N$11
  Top 0.406: LED3.2A 8.21,72.27 8.89,71.59 R8.1
N$12
  Top 0.406: R7.1 4.06,75.4 2.76,74.1 LED3.1A
N$13
  Top 0.406: LED5.2A 11.2,56.27 R11.1
N$14
  Top 0.406: R12.1 8.51,59.78 7.62,58.89 3.81,58.89 2.76,57.84 LED5.1A
N$15
  Top 0.406: LED6.2A 11.2,48.27 R14.1
N$16
  Top 0.406: R15.1 9.02,52.16 7.37,50.51 3.56,50.51 2.76,49.71 LED6.1A
N$17
  Top 0.305: IC1.8 104.27,85.66 Q5.2
  Bottom 0.305: C8.1 104.14,88.23 Q5.2
N$19
  Top 0.305: IC2.8 100.76,34.43 Q4.2
  Bottom 0.305: C6.1 Q4.2
P1_!RST
  Top 0.305: IC2.4 103.17,37.63 96.65,44.16 93.47,44.16 JP1.2
P2_!RST  (via drill 0.3)
  Top 0.305: IC1.29 113.43,78.34 v113.35,78.26 | JP1.6 93.98,56.35 93.98,58.89 100.97,65.88 v100.97,75.4
  Bottom 0.305: v100.97,75.4 102.23,76.67 111.76,76.67 v113.35,78.26
P2_LED_PANEL  (via drill 0.3)
  Top 0.305: IC1.23 112.49,72.32 v111.76,71.59 | v99.06,71.59 74.93,71.59 71.12,75.4 R7.2
  Bottom 0.305: v99.06,71.59 v111.76,71.59
P2RX
  Top 0.305: IC1.30 116.77,79.14 116.84,79.21 124.46,79.21 127.64,76.03 136.21,76.03 138.75,73.5 138.75,65.88 140.65,63.97 IC4.12
P2TX
  Top 0.305: IC1.31 116.75,79.94 116.84,79.84 124.78,79.84 127.95,76.67 136.53,76.67 139.38,73.81 139.38,66.19 140.34,65.24 143.83,65.24 144.78,64.29 144.78,62.06 144.15,61.43 IC4.11
P3_!RST  (via drill 0.3)
  Top 0.305: IC3.29 113.43,60.56 v113.35,60.48
  Bottom 0.305: v113.35,60.48 112.08,61.75 102.87,61.75 101.6,60.48 101.6,58.89 97.79,55.08 92.71,55.08 91.44,53.81 91.44,51.27 JP1.4
P3_LED_PANEL  (via drill 0.3)
  Top 0.305: R8.2 71.12,71.59 85.09,57.62 v92.08,57.62 | v95.89,57.62 v99.69,53.81 | IC3.23 112.49,54.22 v112.39,54.13
  Bottom 0.305: v92.08,57.62 v95.89,57.62 | v99.69,53.81 112.08,53.81 v112.39,54.13
P3RX
  Top 0.305: IC3.30 116.45,61.36 116.52,61.43 123.51,61.43 125.41,59.52 130.49,59.52 132.4,57.62 138.43,57.62 139.7,56.35 IC4.9
P3TX
  Top 0.305: IC4.10 139.7,58.89 138.43,60.16 125.73,60.16 123.83,62.06 116.52,62.06 116.43,62.16 IC3.31
PROG_!RST
  Bottom 0.305: JP1.1 JP1.3 | JP1.3 JP1.5 | JP1.3 96.52,50 98.42,51.91 107.95,51.91 109.22,50.63 U1.4
PX_MISO  (via drill 0.3)
  Top 0.305: 106.2,56.35 106.2,53.33 104.14,51.27 U1.2 104.14,42.38 106.36,40.16 106.36,39.84 105.75,39.23 IC2.2 | 106.2,56.35 IC3.16 | IC1.16 104.2,75.14 103.82,74.77 103.82,60.48 v104.46,59.84 | 106.2,56.35 v104.46,56.35
  Bottom 0.305: v104.46,56.35 v104.46,59.84
PX_MOSI
  Top 0.305: 104.68,58.16 IC3.15 | 104.68,58.16 101.6,55.08 U1.1 101.6,42.38 103.95,40.03 IC2.1 | IC1.15 103.73,75.94 103.19,75.4 103.19,59.65 104.68,58.16
PX_SCK  (via drill 0.3)
  Top 0.305: U1.3 106.68,51.27 107.69,52.28 IC3.17 107.69,62.96 106.68,63.97 106.68,66.51 107.63,67.46 107.63,72.54 107.69,72.6 IC1.17 | IC2.3 103.33,38.43 100.33,41.43 v100.33,45.55
  Bottom 0.305: U1.3 106.68,46.51 v105.73,45.55 v100.33,45.55
ROT_VYMERA
  Top 0.406: IC2.36 112.89,43.89 113.79,44.79 115.95,44.79 117.22,46.06 117.22,53.94 118.16,54.88 R13.2 120.62,55.74 Q3.1
ROT_VYMERA_GREEN  (via drill 0.3 pad 0.9)
  Top 0.406: R14.2 31.88,48.22 53.66,26.44 54.1,26 v54.61,25.49 | IC2.13 107.29,27.93 108.08,27.14 v108.08,25.36
  Bottom 0.406: v108.08,25.36 54.74,25.36 v54.61,25.49
ROT_VYMERA_RED  (via drill 0.3 pad 0.9)
  Top 0.406: R15.2 35.81,52.16 v60.83,27.14 | IC2.12 v106.49,27.08
  Bottom 0.406: v106.49,27.08 60.9,27.08 v60.83,27.14
ROTVYM_A
  Top 1.27: J1.C16 147.64,53.24 147.46,53.43 Q3.4 Q3.2
SYS_RS+
  Top 0.406: IC6.6 148.99,16.34 J1.C30
SYS_RS-
  Top 0.406: IC6.7 146.69,17.62 147.32,18.25 152.16,18.25 J1.A30
SYS_RX
  Top 0.305: IC6.1 135.25,18.89 134.62,18.25 107.95,18.25 105.41,20.79 105.41,30.95 106.36,31.9 106.36,33.17 105.91,33.63 IC2.9
SYS_TE
  Top 0.305: IC6.2 IC6.3 135.25,16.34 134.62,16.98 106.68,16.98 104.69,18.97 IC2.11
SYS_TX
  Top 0.305: IC6.4 135.25,15.08 134.62,15.71 104.14,15.71 102.87,16.98 102.87,32.22 103.48,32.83 IC2.10

### Text on the board
Top: V-00492-01 / LIC_rack_TS-01 / Lukas Novak / 30.07.2015